# Altium schematic sheet Supply_core.SchDoc
size 594 x 420 mm; SheetNumber: 2; SheetTotal: 3
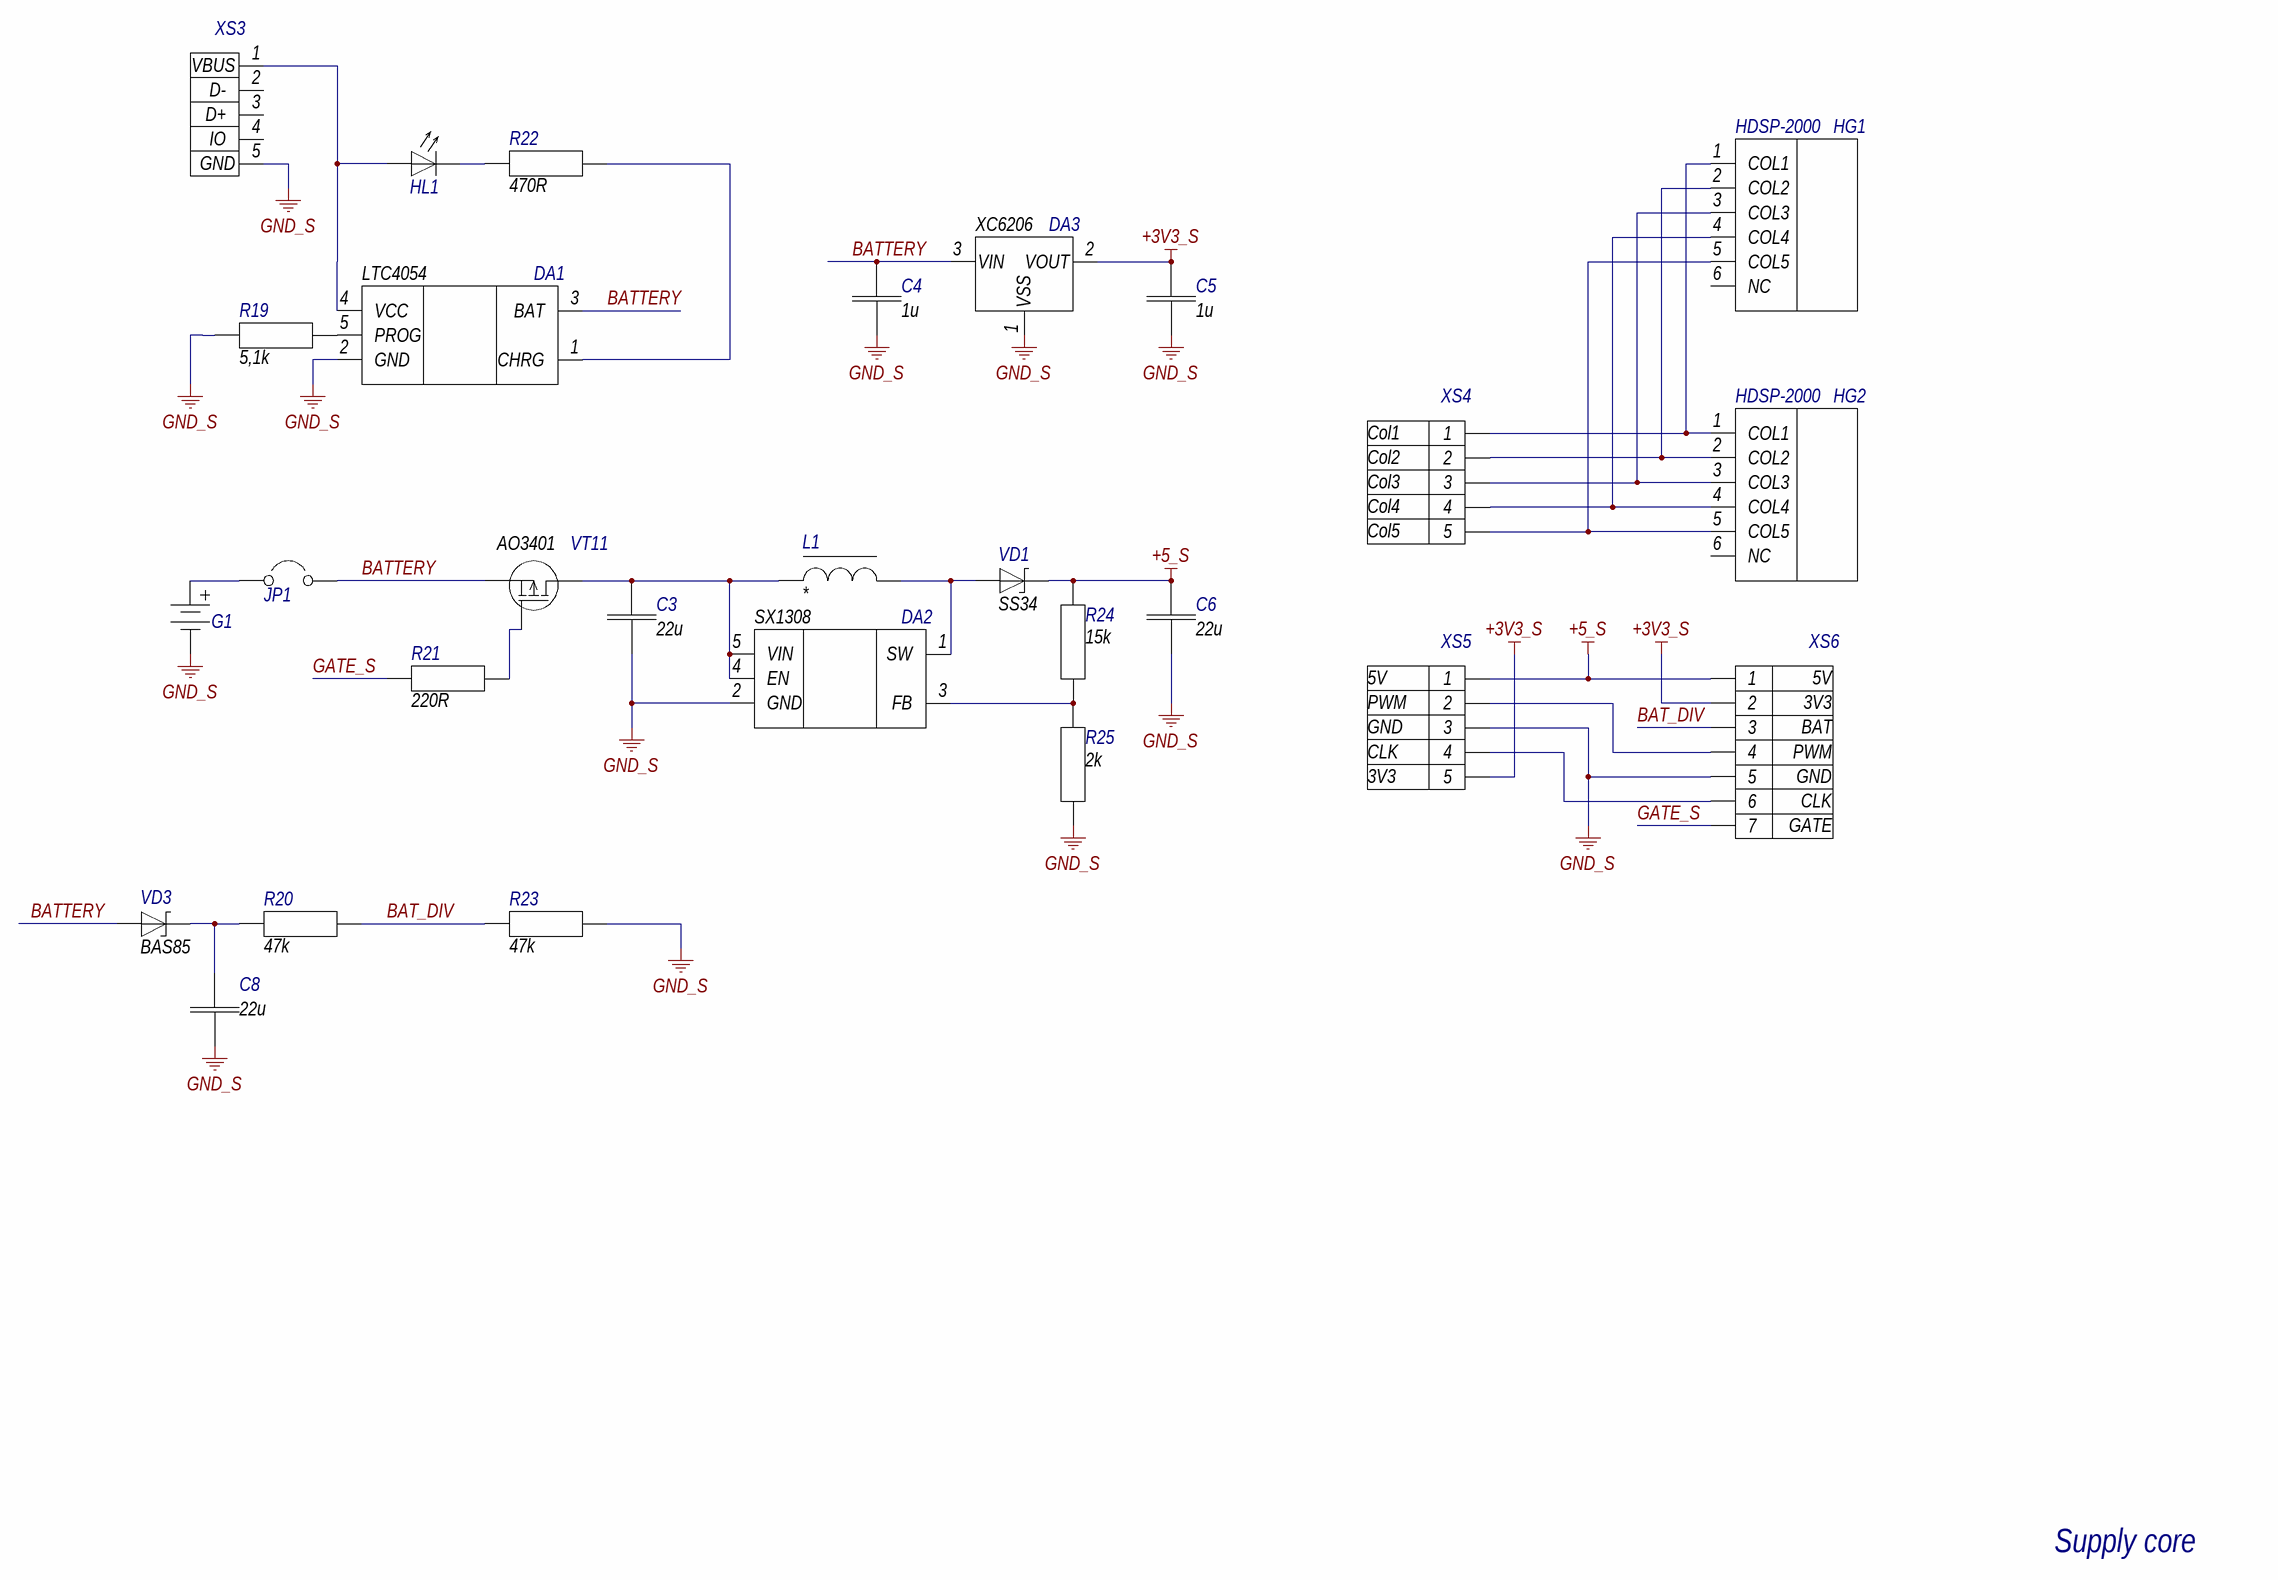
[diagram p0: Supply_core.SchDoc]

## Parts
C3  value 22u  [CHIP-0805]  (hidden comment: C0805)
C4  value 1u  [CHIP-0603]  (hidden comment: C0805)
C5  value 1u  [CHIP-0603]  (hidden comment: C0805)
C6  value 22u  [CHIP-0805]  (hidden comment: C0805)
C8  value 22u  [CHIP-0805]  (hidden comment: C0805)
DA1  LTC4054  [SOT23-5]
DA2  SX1308  [SOT23-6]
DA3  XC6206  [SOT23-3]
G1  Battery  [BATTERY]  (value not drawn)
HG1  Name: HDSP-2000  [HDSP-2000_COL]  (hidden comment: HDSP-2000_Colums)
HG2  Name: HDSP-2000  [HDSP-2000_COL]  (hidden comment: HDSP-2000_Colums)
HL1  LED  [LED_1]  (value not drawn)
JP1  Jamper  [JAMPER]  (value not drawn)
L1  L  [L_SMD]  (value not drawn)
R19  value 5,1k  [CHIP-0402]  (hidden comment: R0805)
R20  value 47k  [CHIP-0402]  (hidden comment: R0805)
R21  value 220R  [CHIP-0805]  (hidden comment: R0805)
R22  value 470R  [CHIP-0805]  (hidden comment: R0805)
R23  value 47k  [CHIP-0402]  (hidden comment: R0805)
R24  value 15k  [CHIP-0805]  (hidden comment: R0805)
R25  value 2k  [CHIP-0805]  (hidden comment: R0805)
VD1  SS34  [DIOD]
VD3  BAS85  [DIOD_MELF]
VT11  Name: AO3401  [SOT23-3]  (hidden comment: AO3401A)
XS3  Micro_USB  [Micro_USB]  (value not drawn)
XS4  Pin5: Col5  Pin4: Col4  Pin3: Col3  Pin2: Col2  Pin1: Col1  [SOCKET]  (hidden comment: Socket)
XS5  Pin5: 3V3  Pin4: CLK  Pin3: GND  Pin2: PWM  Pin1: 5V  [SOCKET]  (hidden comment: Socket)
XS6  Pin7: GATE  Pin6: CLK  Pin5: GND  Pin4: PWM  Pin3: BAT  Pin2: 3V3  Pin1: 5V  [SOCKET_7]  (hidden comment: Socket_7)

## Nets
+3V3_S: C5.2 DA3.2(VOUT) XS5.5 XS6.2
+5_S: C6.2 R24.2 VD1.1(K) XS5.1 XS6.1
GND_S: C3.1 C4.1 C5.1 C6.1 C8.1 DA1.2(GND) DA2.2(GND) DA3.1(VSS) G1.2 R19.1 R23.2 R25.1 XS3.5(GND) XS5.3 XS6.5
BAT_DIV: R20.2 R23.1 XS6.3
BATTERY: C4.2 DA1.3(BAT) DA3.3(VIN) JP1.2 VD3.2(A) VT11.2(S)
GATE_S: R21.1 XS6.7
NetC3_2: C3.2 DA2.4(EN) DA2.5(VIN) L1.1 VT11.3(D)
NetC8_2: C8.2 R20.1 VD3.1(K)
NetDA1_1: DA1.1(CHRG) R22.2
NetDA1_4: DA1.4(VCC) HL1.2(A) XS3.1(VBUS)
NetDA1_5: DA1.5(PROG) R19.2
NetDA2_1: DA2.1(SW) L1.2 VD1.2(A)
NetDA2_3: DA2.3(FB) R24.1 R25.2
NetG1_1: G1.1 JP1.1
NetHG1_1: HG1.1(COL1) HG2.1(COL1) XS4.1
NetHG1_2: HG1.2(COL2) HG2.2(COL2) XS4.2
NetHG1_3: HG1.3(COL3) HG2.3(COL3) XS4.3
NetHG1_4: HG1.4(COL4) HG2.4(COL4) XS4.4
NetHG1_5: HG1.5(COL5) HG2.5(COL5) XS4.5
NetHL1_1: HL1.1(K) R22.1
NetR21_2: R21.2 VT11.1(G)
NetXS5_2: XS5.2 XS6.4
NetXS5_4: XS5.4 XS6.6

Not connected (* = marked no-connect by the designer): HG1 6(NC); HG2 6(NC); XS3 2(D-) 3(D+) 4(IO)

## Notes on the sheet
- Supply core
- Перв. застосув.
- Справ. №
- Підп. дата
- Інв. № дубл.
- Взам. інв. №
- Підп. та дата
- Зм.
- Розроб.
- Арк.
- № докум.
- Підп.
- Дата
- Літ.
- Маса
- Маштаб
- Перев.
- Аркушів
- Інв. № подл.
- Н.контр.
- Затв.
- КПІ ім. Ігоря Сікорського
- ALTIUM GOSTBOM2.0 KEV
- Копіював
- Формат А2

## Library data of the parts
HG1 HG2 = HDSP-2000_Colums: Manufacturer: HP
DA1 = LTC4054: Name: LTC4054
DA2 = SX1308: Name: SX1308
DA3 = XC6206: Name: XC6206
HL1 = LED: Name: LED
L1 = L: Value: *
VD1 = SS34: Name: SS34
VD3 = BAS85: Name: BAS85